# Altium project B108AA.PrjPcb (part 3 of 4)

## Sheet GSM Modem Antenna.SchDoc: GSM 2G Antenna Filter
size 292 x 193 mm; DocumentNumber: 14; SheetNumber: 34; SheetTotal: 40
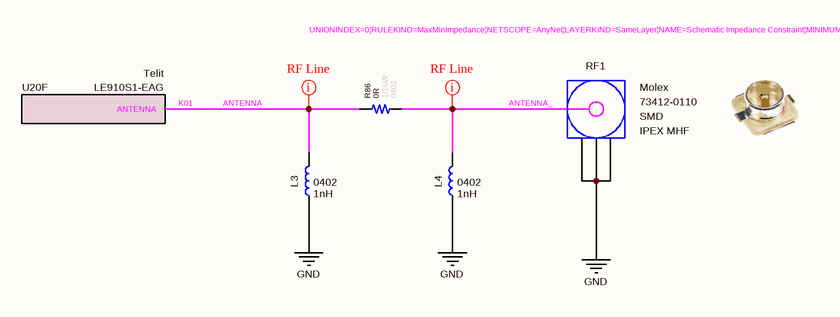
[diagram p25: GSM Modem Antenna.SchDoc]

### Parts
L3  value 1nH  Case: 0402  [INDUCTOR_0402]  (hidden comment: Fixed Inductor)
L4  value 1nH  Case: 0402  [INDUCTOR_0402]  (hidden comment: Fixed Inductor)
R86  value 0R  Case: 0402  Power: 1/16W  [RESISTOR_0402]  (hidden comment: 0R - 0402 - %1 - 1/16W)
RF1  Connector Type: IPEX MHF  Case: SMD  Manufacturer Name: Molex  [Connector_IPEX]  (hidden comment: 73412-0110)
U20  Manufacturer Part Number: LE910S1-EAG  Manufacturer Name: Telit  [LE910 GSM Modem]  (hidden comment: LE910S1-EAG LTE GSM Module)  (part F of 19)

### Nets
GND: L3.1 L4.1 RF1.2(GND) RF1.3(GND) RF1.4(GND)
ANTENNA: L3.2 R86.2 U20.K01(ANTENNA)
ANTENNA_: L4.2 R86.1 RF1.1(Signal)

### Layout directives
rule Impedance Constraint [Min = 49.00    Max = 50.00    ]: ANTENNA, ANTENNA_

### Notes on the sheet
- © 2021 All rights reserved.
  This document may not, in whole or in part, be copied, photocopied, reproduced, translated or converted to any electronic or machine readable from without prior written permission of Mehmet Günce Akkoyun.
  Engineer contact : akkoyun@me.com
- Property of
- Engineer :
- Date :
- Size :
- A4
- Time :
- Project :
- Page :
- /
- Customer :
- Product ID :
- Module ID :
- Version :
- File :
- Revision :

### Library data of the parts
L3 L4 = Inductor - 1nH [0402]: Manufacturer Name: Murata Electronics; Manufacturer Part Number: LQG15HN1N0S02D; Tolerance: 0.3 nH; Height: 0.35mm; ComponentLink1Description: DataSheet; ComponentLink1URL: https://www.mouser.com.tr/datasheet/2/281/JELF243B-0009-1699631.pdf
R86 = Resistor - 0R [0402]: Thick Film Resistors - SMD 1/16 W 0 Ohm; Manufacturer Name: Vishay; Manufacturer Part Number: CRCW04020000Z0ED; ComponentLink1Description: DataSheet; ComponentLink1URL: https://www.mouser.com.tr/datasheet/2/427/dcrcwe3-1762152.pdf; ComponentLink2Description: Mouser; ComponentLink2URL: https://www.mouser.com.tr/ProductDetail/Vishay-Dale/CRCW04020000Z0ED?qs=sGAEpiMZZMu61qfTUdNhG2DpbjADlD3GG34cJb50zyg%3D
RF1 = Connector - IPEX MHF: MOLEX   73412-0110   RF COAXIAL, MICROCOAXIAL, JACK, 50OHM; ROHS: Yes; Product Type: RF Connectors; Impedance: 50 Ohm; Manufacturer Part Number: 73412-0110
U20 = IC - LE910S1-EAG: Telit LE910S1-EAG GPRS/GNSS Module; Case: BGA

## Sheet GSM Status LED Driver.SchDoc: Status LED Driver
size 292 x 193 mm; SheetNumber: 32; SheetTotal: 40
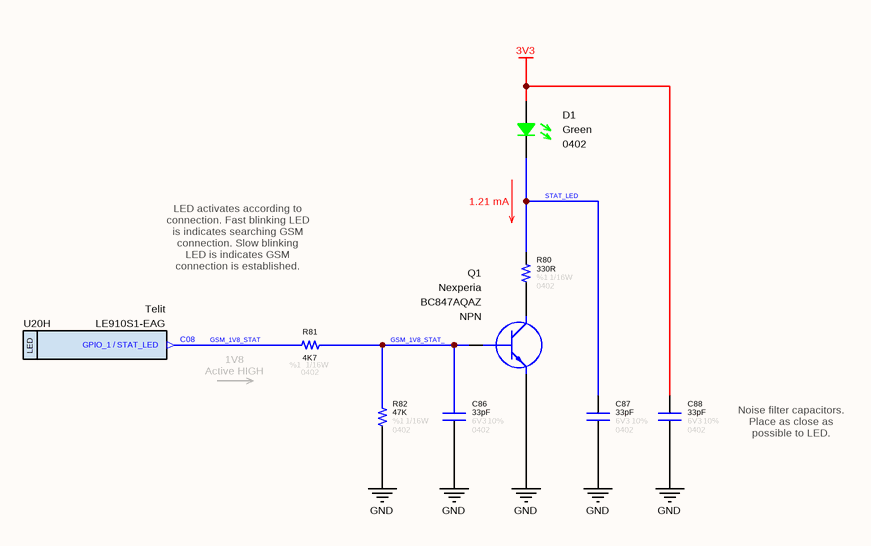
[diagram p26: GSM Status LED Driver.SchDoc]

### Parts
C86  value 33pF  Tolerance: 10%  Case: 0402  Voltage: 6V3  [CAPACITOR_0402]  (hidden comment: Capacitor - 33pF [0402] (Ceramic))
C87  value 33pF  Tolerance: 10%  Case: 0402  Voltage: 6V3  [CAPACITOR_0402]  (hidden comment: Capacitor - 33pF [0402] (Ceramic))
C88  value 33pF  Tolerance: 10%  Case: 0402  Voltage: 6V3  [CAPACITOR_0402]  (hidden comment: Capacitor - 33pF [0402] (Ceramic))
D1  Case: 0402  Color: Green  [LED_0402]  (hidden comment: SMD LED (Green))
Q1  Manufacturer Name: Nexperia  Polarity: NPN  [SOT1215]  (hidden comment: BC847AQAZ)
R80  value 330R  Case: 0402  Tolerance: %1  Power: 1/16W  [RESISTOR_0402]  (hidden comment: 330R - 0402 - %1 - 1/16W)
R81  value 4K7  Tolerance: %1  Case: 0402  Power: 1/16W  [RESISTOR_0402]  (hidden comment: 4K7 - 0402 - %1 - 1/16W)
R82  value 47K  Tolerance: %1  Case: 0402  Power: 1/16W  [RESISTOR_0402]  (hidden comment: 47K - 0402 - %1 - 1/16W)
U20  Manufacturer Part Number: LE910S1-EAG  Manufacturer Name: Telit  [LE910 GSM Modem]  (hidden comment: LE910S1-EAG LTE GSM Module)  (part H of 19)

### Nets
3V3: C88.2 D1.2
GND: C86.1 C87.1 C88.1 Q1.2(E) R82.1
GSM_1V8_STAT: R81.2 U20.C08(GPIO_1_/_STAT_LED)
GSM_1V8_STAT_: C86.2 Q1.1(B) R81.1 R82.2
STAT_LED: C87.2 D1.1 R80.2
NetQ1_3: Q1.3(C) R80.1

### Notes on the sheet
- 1.21 mA
- LED activates according to connection. Fast blinking LED is indicates searching GSM connection. Slow blinking LED is indicates GSM connection is established.
- 1V8
  Active HIGH
- Noise filter capacitors. Place as close as possible to LED.
- © 2022 All rights reserved.
  This document may not, in whole or in part, be copied, photocopied, reproduced, translated or converted to any electronic or machine readable from without prior written permission of Mehmet Günce Akkoyun.
  Engineer contact : akkoyun@me.com
- Property of
- Engineer :
- Date :
- Size :
- A4
- Time :
- Project :
- Page :
- /
- Customer :
- Product ID :
- Module ID :
- Version :
- File :
- Revision :
- (in symbol IC - LE910S1-EAG, part H) LED

### Library data of the parts
C86-C88 = Capacitor - 33pF [0402-6V3]: Manufacturer Name: Kemet; Manufacturer Part Number: C0402C330J9RACAUTO; ComponentLink1Description: DataSheet; ComponentLink1URL: https://api.kemet.com/component-edge/download/datasheet/C0402C330J9RACAUTO.pdf; ComponentLink2Description: Mouser; ComponentLink2URL: https://www.mouser.com/Search/Refine.aspx?Keyword=80-C0402C330J9RAUTO
D1 = Diode - LED (0402-Green): Standard LEDs - SMD MINI-MOLD ULTRA COMPACT GREEN; Manufacturer Name: ROHM Semiconductor; Manufacturer Part Number: SML-P12MTT86R; ROHS: Yes; ComponentLink1Description: DataSheet; ComponentLink1URL: https://www.mouser.com.tr/datasheet/2/348/sml-p1-e-1139198.pdf; ComponentLink2Description: Mouser; ComponentLink2URL: https://www.mouser.com.tr/ProductDetail/ROHM-Semiconductor/SML-P12U2TT86R?qs=sGAEpiMZZMseGfSY3csMkRIBDsfU3UCXJTULB5gem9Ta%252Bp%252BvZ709fg%3D%3D
Q1 = Transistor - BC847: Bipolar NPN Transistors; Case: DFN-1010D-3; Manufacturer Part Number: BC847AQAZ
R80 = Resistor - 330R [0402]: Thick Film Resistors - SMD 1/16 W 330 Ohm 1%; Manufacturer Name: Vishay; Manufacturer Part Number: CRCW0402330RFKED; ComponentLink1Description: DataSheet; ComponentLink1URL: https://www.mouser.com.tr/datasheet/2/427/dcrcwe3-1762152.pdf; ComponentLink2Description: Mouser; ComponentLink2URL: https://www.mouser.com.tr/ProductDetail/Vishay-Dale/CRCW0402330RFKED?qs=sGAEpiMZZMu61qfTUdNhG2DpbjADlD3GGS6SwBlLi5Q%3D
R81 = Resistor - 4K7 [0402]: Thick Film Resistors - SMD 1/16 W 4.7 KOhm 1%; Manufacturer Name: Vishay; Manufacturer Part Number: CRCW04024K70FKED; ComponentLink1Description: DataSheet; ComponentLink1URL: https://www.mouser.com.tr/datasheet/2/427/dcrcwe3-1762152.pdf; ComponentLink2Description: Mouser; ComponentLink2URL: https://www.mouser.com.tr/ProductDetail/Vishay-Dale/CRCW04024K70FKED?qs=sGAEpiMZZMu61qfTUdNhG7nHf%2F6MTUn3HadIdDQu24Q%3D
R82 = Resistor - 47K [0402]: Thick Film Resistors - SMD 1/16 W 47 KOhm 1%; Manufacturer Name: Vishay; Manufacturer Part Number: CRCW040247K0FKED; ComponentLink1Description: DataSheet; ComponentLink1URL: https://www.mouser.com.tr/datasheet/2/427/dcrcwe3-1762152.pdf; ComponentLink2Description: Mouser; ComponentLink2URL: https://www.mouser.com.tr/ProductDetail/Vishay-Dale/CRCW040247K0FKED?qs=sGAEpiMZZMu61qfTUdNhG2DpbjADlD3GL%252B3h1elTxqU%3D
U20 = IC - LE910S1-EAG: Telit LE910S1-EAG GPRS/GNSS Module; Case: BGA

## Sheet GSM SIM Socket.SchDoc: GSM SIM Socket
size 292 x 193 mm; DocumentNumber: 15; SheetNumber: 30; SheetTotal: 40
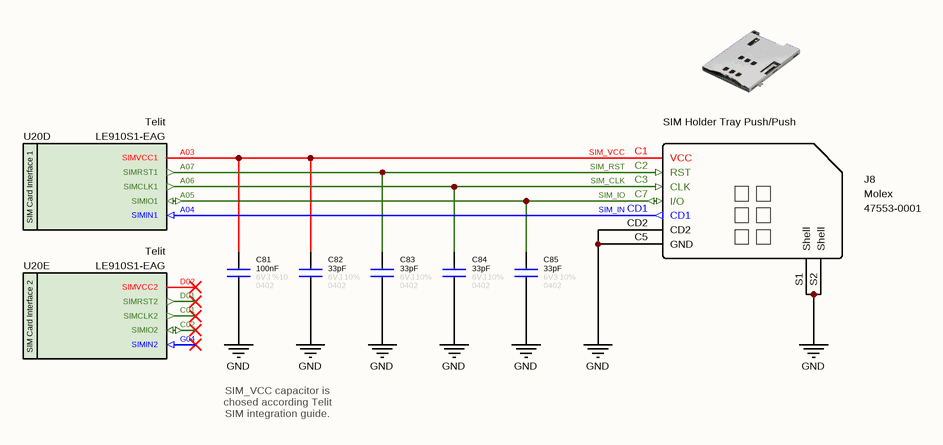
[diagram p27: GSM SIM Socket.SchDoc]

### Parts
C81  value 100nF  Tolerance: %10  Voltage: 6V3  Case: 0402  [CAPACITOR_0402]  (hidden comment: Capacitor - 100nF [0402] (Ceramic))
C82  value 33pF  Tolerance: 10%  Case: 0402  Voltage: 6V3  [CAPACITOR_0402]  (hidden comment: Capacitor - 33pF [0402] (Ceramic))
C83  value 33pF  Tolerance: 10%  Case: 0402  Voltage: 6V3  [CAPACITOR_0402]  (hidden comment: Capacitor - 33pF [0402] (Ceramic))
C84  value 33pF  Tolerance: 10%  Case: 0402  Voltage: 6V3  [CAPACITOR_0402]  (hidden comment: Capacitor - 33pF [0402] (Ceramic))
C85  value 33pF  Tolerance: 10%  Case: 0402  Voltage: 6V3  [CAPACITOR_0402]  (hidden comment: Capacitor - 33pF [0402] (Ceramic))
J8  Card Type: SIM Holder Tray Push/Push  Manufacturer Name: Molex  Manufacturer Part Number: 47553-0001  [CONNECTOR - SIM Card]  (hidden comment: SIM Holder Tray)
U20  Manufacturer Part Number: LE910S1-EAG  Manufacturer Name: Telit  [LE910 GSM Modem]  (hidden comment: LE910S1-EAG LTE GSM Module)  (parts D,E of 19)

### Nets
GND: C81.1 C82.1 C83.1 C84.1 C85.1 J8.C5(GND) J8.CD2 J8.S1(Shell) J8.S2(Shell)
SIM_CLK: C84.2 J8.C3(CLK) U20.A06(SIMCLK1)
SIM_IN: J8.CD1 U20.A04(SIMIN1)
SIM_IO: C85.2 J8.C7(I/O) U20.A05(SIMIO1)
SIM_RST: C83.2 J8.C2(RST) U20.A07(SIMRST1)
SIM_VCC: C81.2 C82.2 J8.C1(VCC) U20.A03(SIMVCC1)

Not connected (* = marked no-connect by the designer): U20 C01(SIMCLK2)* C02(SIMIO2)* D01(SIMRST2)* D02(SIMVCC2)* G04(SIMIN2)*

### Notes on the sheet
- SIM_VCC capacitor is chosed according Telit SIM integration guide.
- © 2021 All rights reserved.
  This document may not, in whole or in part, be copied, photocopied, reproduced, translated or converted to any electronic or machine readable from without prior written permission of Mehmet Günce Akkoyun.
  Engineer contact : akkoyun@me.com
- Property of
- Engineer :
- Date :
- Size :
- A4
- Time :
- Project :
- Page :
- /
- Customer :
- Product ID :
- Module ID :
- Version :
- File :
- Revision :
- (in symbol IC - LE910S1-EAG, part D) SIM Card Interface 1
- (in symbol IC - LE910S1-EAG, part E) SIM Card Interface 2

### Library data of the parts
C81 = Capacitor - 100nF [0402-6V3]: Capacitor - 100nF [0402-6V3] (Ceramic); Manufacturer Name: AVX; Manufacturer Part Number: 04026D104KAT4A; ComponentLink1Description: Mouser; ComponentLink1URL: https://www.mouser.com.tr/ProductDetail/AVX/04026D104KAT4A?qs=sGAEpiMZZMs0AnBnWHyRQPg4iYkCw7IMED%2F4kpqgf7w%3D; ComponentLink2Description: DataSheet; ComponentLink2URL: https://www.mouser.com.tr/datasheet/2/40/cx5r-776519.pdf
C82-C85 = Capacitor - 33pF [0402-6V3]: as C86 on sheet GSM Status LED Driver; ComponentLink1Description: DataSheet; ComponentLink1URL: https://api.kemet.com/component-edge/download/datasheet/C0402C330J9RACAUTO.pdf; ComponentLink2Description: Mouser; ComponentLink2URL: https://www.mouser.com/Search/Refine.aspx?Keyword=80-C0402C330J9RAUTO
J8 = Connector - Sim Holder: Memory Card Connectors ASSY 1.90 SIM CARD R IM CARD READER CONN.
U20 = IC - LE910S1-EAG: Telit LE910S1-EAG GPRS/GNSS Module; Case: BGA

## Sheet GSM Power Source.SchDoc: GSM IoT Power Filter
size 393 x 292 mm; DocumentNumber: 8; SheetNumber: 24; SheetTotal: 40
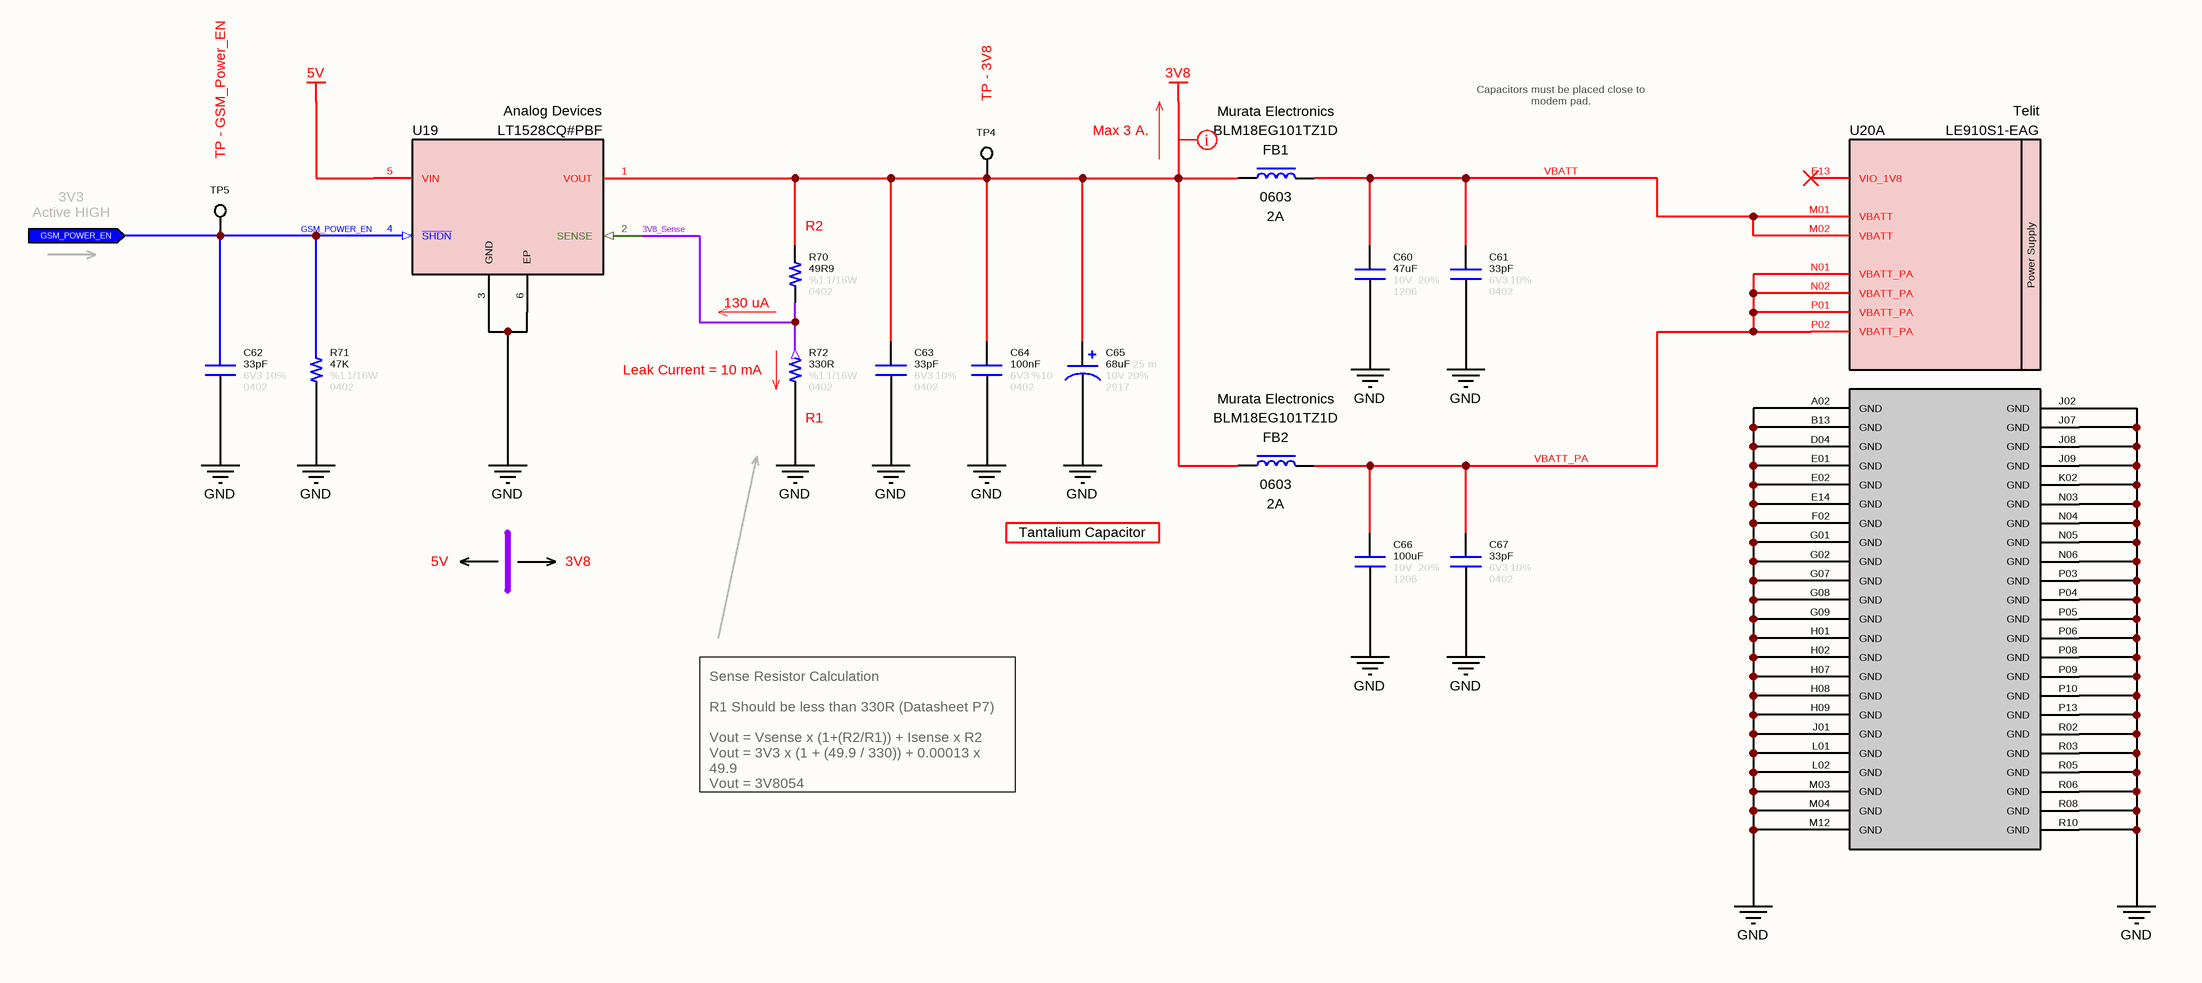
[diagram p28: GSM Power Source.SchDoc]

### Parts
C60  value 47uF  Tolerance: 20%  Case: 1206  Voltage: 10V  [CAPACITOR_1206]  (hidden comment: Capacitor - 47uF [1206] (Ceramic))
C61  value 33pF  Tolerance: 10%  Case: 0402  Voltage: 6V3  [CAPACITOR_0402]  (hidden comment: Capacitor - 33pF [0402] (Ceramic))
C62  value 33pF  Tolerance: 10%  Case: 0402  Voltage: 6V3  [CAPACITOR_0402]  (hidden comment: Capacitor - 33pF [0402] (Ceramic))
C63  value 33pF  Tolerance: 10%  Case: 0402  Voltage: 6V3  [CAPACITOR_0402]  (hidden comment: Capacitor - 33pF [0402] (Ceramic))
C64  value 100nF  Tolerance: %10  Voltage: 6V3  Case: 0402  [CAPACITOR_0402]  (hidden comment: Capacitor - 100nF [0402] (Ceramic))
C65  value 68uF  ESR: 25 m  Tolerance: 20%  Case: 2917  Voltage: 10V  [CAP_10TPE68M]  (hidden comment: Capacitor - 68uF [2917] (Tantalum))
C66  value 100uF  Tolerance: 20%  Case: 1206  Voltage: 10V  [CAPACITOR_1206]  (hidden comment: Capacitor - 100uF [1206] (Ceramic))
C67  value 33pF  Tolerance: 10%  Case: 0402  Voltage: 6V3  [CAPACITOR_0402]  (hidden comment: Capacitor - 33pF [0402] (Ceramic))
FB1  Maximum DC Current: 2A  Case: 0603  Manufacturer Part Number: BLM18EG101TZ1D  Manufacturer Name: Murata Electronics  [INDUCTOR_0603]  (hidden comment: Ferrite Bead)
FB2  Maximum DC Current: 2A  Case: 0603  Manufacturer Part Number: BLM18EG101TZ1D  Manufacturer Name: Murata Electronics  [INDUCTOR_0603]  (hidden comment: Ferrite Bead)
R70  value 49R9  Case: 0402  Tolerance: %1  Power: 1/16W  [RESISTOR_0402]  (hidden comment: 49R9 - 0402 - %1 - 1/16W)
R71  value 47K  Tolerance: %1  Case: 0402  Power: 1/16W  [RESISTOR_0402]  (hidden comment: 47K - 0402 - %1 - 1/16W)
R72  value 330R  Case: 0402  Tolerance: %1  Power: 1/16W  [RESISTOR_0402]  (hidden comment: 330R - 0402 - %1 - 1/16W)
TP4  TP - 3V8  [TP]  (no BOM)
TP5  TP - GSM_Power_EN  [TP]  (no BOM)
U19  Manufacturer Part Number: LT1528CQ#PBF  Manufacturer Name: Analog Devices  [DDPAK-5]  (hidden comment: LDO Regulator)
U20  Manufacturer Part Number: LE910S1-EAG  Manufacturer Name: Telit  [LE910 GSM Modem]  (hidden comment: LE910S1-EAG LTE GSM Module)  (part A of 19)

### Ports
GSM_POWER_EN (in)

### Nets
3V8: C63.2 C64.2 C65.1 FB1.1 FB2.1 R70.2 TP4.1 U19.1(VOUT)
5V: U19.5(VIN)
GND: C60.1 C61.1 C62.1 C63.1 C64.1 C65.2 C66.1 C67.1 R71.1 R72.1 U19.3(GND) U19.6(EP) U20.A02(GND) U20.B13(GND) U20.D04(GND) U20.E01(GND) U20.E02(GND) U20.E14(GND) U20.F02(GND) U20.G01(GND) U20.G02(GND) U20.G07(GND) U20.G08(GND) U20.G09(GND) U20.H01(GND) U20.H02(GND) U20.H07(GND) U20.H08(GND) U20.H09(GND) U20.J01(GND) U20.J02(GND) U20.J07(GND) U20.J08(GND) U20.J09(GND) U20.K02(GND) U20.L01(GND) U20.L02(GND) U20.M03(GND) U20.M04(GND) U20.M12(GND) U20.N03(GND) U20.N04(GND) U20.N05(GND) U20.N06(GND) U20.P03(GND) U20.P04(GND) U20.P05(GND) U20.P06(GND) U20.P08(GND) U20.P09(GND) U20.P10(GND) U20.P13(GND) U20.R02(GND) U20.R03(GND) U20.R05(GND) U20.R06(GND) U20.R08(GND) U20.R10(GND)
3V8_Sense: R70.1 R72.2 U19.2(SENSE)
GSM_POWER_EN: C62.2 R71.2 TP5.1 U19.4(~{SHDN}) ; port GSM_POWER_EN
VBATT: C60.2 C61.2 FB1.2 U20.M01(VBATT) U20.M02(VBATT)
VBATT_PA: C66.2 C67.2 FB2.2 U20.N01(VBATT_PA) U20.N02(VBATT_PA) U20.P01(VBATT_PA) U20.P02(VBATT_PA)

Not connected (* = marked no-connect by the designer): U20 E13(VIO_1V8)*

### Layout directives
rule Supply Nets [Voltage = 3.800]: 3V8

### Notes on the sheet
- Max 3 A.
- Capacitors must be placed close to modem pad.
- 3V3
  Active HIGH
- (near R70) 130 uA
- (near R70) R2
- (near R72) Leak Current = 10 mA
- (near R72) R1
- 5V
- 3V8
- Tantalium Capacitor
- Sense Resistor Calculation
  R1 Should be less than 330R (Datasheet P7)
  Vout = Vsense x (1+(R2/R1)) + Isense x R2
  Vout = 3V3 x (1 + (49.9 / 330)) + 0.00013 x 49.9
  Vout = 3V8054
- © 2022 All rights reserved.
  This document may not, in whole or in part, be copied, photocopied, reproduced, translated or converted to any electronic or machine readable from without prior written permission of Mehmet Günce Akkoyun.
  Engineer contact : akkoyun@me.com
- Property of
- Engineer :
- Date :
- Size :
- A3
- Time :
- Project :
- Page :
- /
- Customer :
- Product ID :
- Module ID :
- Version :
- File :
- Revision :
- (in symbol IC - LE910S1-EAG, part A) Power Supply

### Library data of the parts
C60 = Capacitor - 47uF [1206-10V]: Multilayer Ceramic Capacitors MLCC - SMD/SMT 47UF 10V 20% 1206; Manufacturer Part Number: C1206C476M8PAC; Manufacturer Name: Kemet
C61-C63 C67 = Capacitor - 33pF [0402-6V3]: as C86 on sheet GSM Status LED Driver; ComponentLink1Description: DataSheet; ComponentLink1URL: https://api.kemet.com/component-edge/download/datasheet/C0402C330J9RACAUTO.pdf; ComponentLink2Description: Mouser; ComponentLink2URL: https://www.mouser.com/Search/Refine.aspx?Keyword=80-C0402C330J9RAUTO
C64 = Capacitor - 100nF [0402-6V3]: as C81 on sheet GSM SIM Socket; ComponentLink1Description: Mouser; ComponentLink1URL: https://www.mouser.com.tr/ProductDetail/AVX/04026D104KAT4A?qs=sGAEpiMZZMs0AnBnWHyRQPg4iYkCw7IMED%2F4kpqgf7w%3D; ComponentLink2Description: DataSheet; ComponentLink2URL: https://www.mouser.com.tr/datasheet/2/40/cx5r-776519.pdf
C65 = Capacitor - 68uF [2917-10V] (Tantalium): Tantalum Capacitors - Polymer 10V 68uF 2917 20% ESR=25mOhms; Manufacturer Name: Panasonic; Manufacturer Part Number: 10TPE68M
C66 = Capacitor - 100uF [1206-10V]: Multilayer Ceramic Capacitors MLCC - SMD/SMT 100UF 10V 20% 1206; Manufacturer Part Number: GRM31CR61A107MEA8L; Manufacturer Name: Murata
FB1 FB2 = Inductor - Ferrite Bead [SMD]: Ferrite Beads 0603 100ohms 2000mA Auto Infotainment; Maximum DC Resistance: 45 mOhms; Tolerance: 25%; Value: BLM18EG101TZ1D; Height: 0.75mm; Maximum Operating Temperature: + 125; Minimum Operating Temperature: -55
R70 = Resistor - 49R9 [0402]: Thick Film Resistors - SMD 1/16 W 49.9 Ohm 1%; Manufacturer Name: Vishay; Manufacturer Part Number: CRCW040249R9FKED; ComponentLink1Description: DataSheet; ComponentLink1URL: https://www.mouser.com.tr/datasheet/2/427/dcrcwe3-1762152.pdf; ComponentLink2Description: Mouser; ComponentLink2URL: https://www.mouser.com.tr/ProductDetail/Vishay-Dale/CRCW0402330RFKED?qs=sGAEpiMZZMu61qfTUdNhG2DpbjADlD3GGS6SwBlLi5Q%3D
R71 = Resistor - 47K [0402]: as R82 on sheet GSM Status LED Driver; ComponentLink1Description: DataSheet; ComponentLink1URL: https://www.mouser.com.tr/datasheet/2/427/dcrcwe3-1762152.pdf; ComponentLink2Description: Mouser; ComponentLink2URL: https://www.mouser.com.tr/ProductDetail/Vishay-Dale/CRCW040247K0FKED?qs=sGAEpiMZZMu61qfTUdNhG2DpbjADlD3GL%252B3h1elTxqU%3D
R72 = Resistor - 330R [0402]: as R80 on sheet GSM Status LED Driver; ComponentLink1Description: DataSheet; ComponentLink1URL: https://www.mouser.com.tr/datasheet/2/427/dcrcwe3-1762152.pdf; ComponentLink2Description: Mouser; ComponentLink2URL: https://www.mouser.com.tr/ProductDetail/Vishay-Dale/CRCW0402330RFKED?qs=sGAEpiMZZMu61qfTUdNhG2DpbjADlD3GGS6SwBlLi5Q%3D
TP4 TP5 = PCB - Test Point: Test Point
U19 = IC - LT1528CQ: LDO Voltage Regulators 3A L Drop Reg for uP Applications; Height: 1.45mm; Case: DDPAK-5
U20 = IC - LE910S1-EAG: Telit LE910S1-EAG GPRS/GNSS Module; Case: BGA

## Sheet GSM UnUsed.SchDoc: GSM UnUsed Segment
size 292 x 193 mm; SheetNumber: 37; SheetTotal: 40
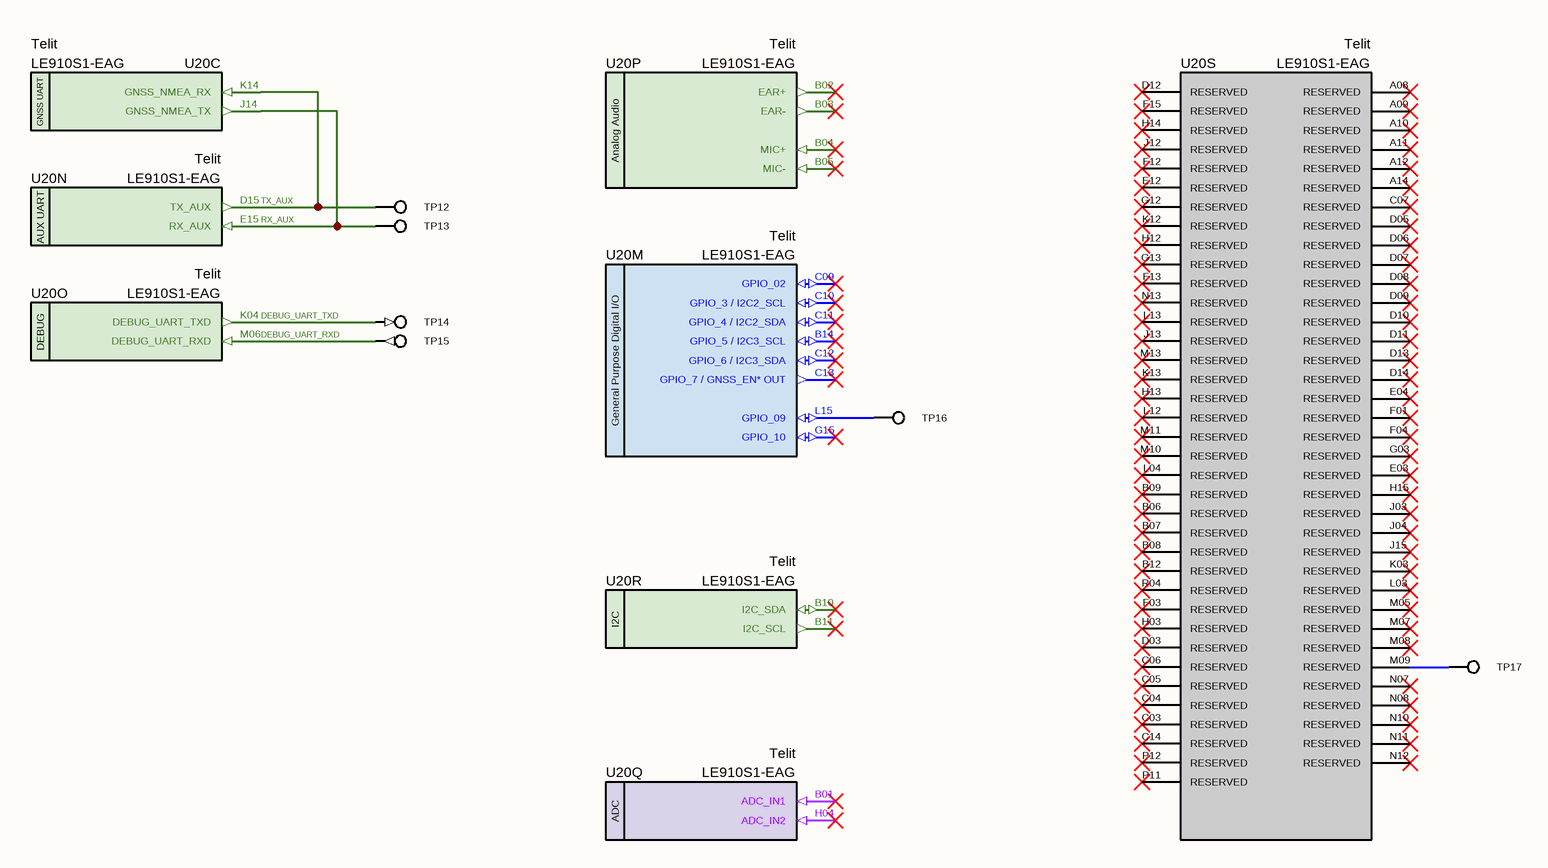
[diagram p29: GSM UnUsed.SchDoc]

### Parts
TP12  TP - GSM_Power_EN  [TP]  (value not drawn)  (no BOM)
TP13  TP - GSM_Power_EN  [TP]  (value not drawn)  (no BOM)
TP14  TP - GSM_Power_EN  [TP]  (value not drawn)  (no BOM)
TP15  TP - GSM_Power_EN  [TP]  (value not drawn)  (no BOM)
TP16  TP - GSM_Power_EN  [TP]  (value not drawn)  (no BOM)
TP17  TP - GSM_Power_EN  [TP]  (value not drawn)  (no BOM)
U20  Manufacturer Part Number: LE910S1-EAG  Manufacturer Name: Telit  [LE910 GSM Modem]  (hidden comment: LE910S1-EAG LTE GSM Module)  (parts C,M,N,O,P,Q,R,S of 19)

### Nets
DEBUG_UART_RXD: TP15.1 U20.M06(DEBUG_UART_RXD)
DEBUG_UART_TXD: TP14.1 U20.K04(DEBUG_UART_TXD)
RX_AUX: TP13.1 U20.E15(RX_AUX) U20.J14(GNSS_NMEA_TX)
TX_AUX: TP12.1 U20.D15(TX_AUX) U20.K14(GNSS_NMEA_RX)
NetTP16_1: TP16.1 U20.L15(GPIO_09)
NetTP17_1: TP17.1 U20.M09(RESERVED)

Not connected (* = marked no-connect by the designer): U20 A08(RESERVED)* A09(RESERVED)* A10(RESERVED)* A11(RESERVED)* A12(RESERVED)* A14(RESERVED)* B01(ADC_IN1)* B02(EAR+)* B03(EAR-)* B04(MIC+)* B05(MIC-)* B06(RESERVED)* B07(RESERVED)* B08(RESERVED)* B09(RESERVED)* B10(I2C_SDA)* B11(I2C_SCL)* B12(RESERVED)* B14(GPIO_5_/_I2C3_SCL)* C03(RESERVED)* C04(RESERVED)* C05(RESERVED)* C06(RESERVED)* C07(RESERVED)* C09(GPIO_02)* C10(GPIO_3_/_I2C2_SCL)* C11(GPIO_4_/_I2C2_SDA)* C12(GPIO_6_/_I2C3_SDA)* C13(GPIO_7_/_GNSS_EN*_OUT)* C14(RESERVED)* D03(RESERVED)* D05(RESERVED)* D06(RESERVED)* D07(RESERVED)* D08(RESERVED)* D09(RESERVED)* D10(RESERVED)* D11(RESERVED)* D12(RESERVED)* D13(RESERVED)* D14(RESERVED)* E03(RESERVED)* E04(RESERVED)* E12(RESERVED)* F01(RESERVED)* F03(RESERVED)* F04(RESERVED)* F12(RESERVED)* F13(RESERVED)* F15(RESERVED)* G03(RESERVED)* G12(RESERVED)* G13(RESERVED)* G15(GPIO_10)* H03(RESERVED)* H04(ADC_IN2)* H12(RESERVED)* H13(RESERVED)* H14(RESERVED)* H15(RESERVED)* J03(RESERVED)* J04(RESERVED)* J12(RESERVED)* J13(RESERVED)* J15(RESERVED)* K03(RESERVED)* K12(RESERVED)* K13(RESERVED)* L03(RESERVED)* L04(RESERVED)* L12(RESERVED)* L13(RESERVED)* M05(RESERVED)* M07(RESERVED)* M08(RESERVED)* M10(RESERVED)* M11(RESERVED)* M13(RESERVED)* N07(RESERVED)* N08(RESERVED)* N10(RESERVED)* N11(RESERVED)* N12(RESERVED)* N13(RESERVED)* P11(RESERVED)* P12(RESERVED)* R04(RESERVED)*

### Notes on the sheet
- © 2021 All rights reserved.
  This document may not, in whole or in part, be copied, photocopied, reproduced, translated or converted to any electronic or machine readable from without prior written permission of Mehmet Günce Akkoyun.
  Engineer contact : akkoyun@me.com
- Property of
- Engineer :
- Date :
- Size :
- A4
- Time :
- Project :
- Page :
- /
- Customer :
- Product ID :
- Module ID :
- Version :
- File :
- Revision :
- (in symbol IC - LE910S1-EAG, part C) GNSS UART
- (in symbol IC - LE910S1-EAG, part M) General Purpose Digital I/O
- (in symbol IC - LE910S1-EAG, part N) AUX UART
- (in symbol IC - LE910S1-EAG, part O) DEBUG
- (in symbol IC - LE910S1-EAG, part P) Analog Audio
- (in symbol IC - LE910S1-EAG, part Q) ADC
- (in symbol IC - LE910S1-EAG, part R) I2C

### Library data of the parts
TP12-TP17 = PCB - Test Point: Test Point
U20 = IC - LE910S1-EAG: Telit LE910S1-EAG GPRS/GNSS Module; Case: BGA

## Sheet GNSS Antenna.SchDoc: GNSS Antenna & LNA
size 292 x 193 mm; SheetNumber: 35; SheetTotal: 40
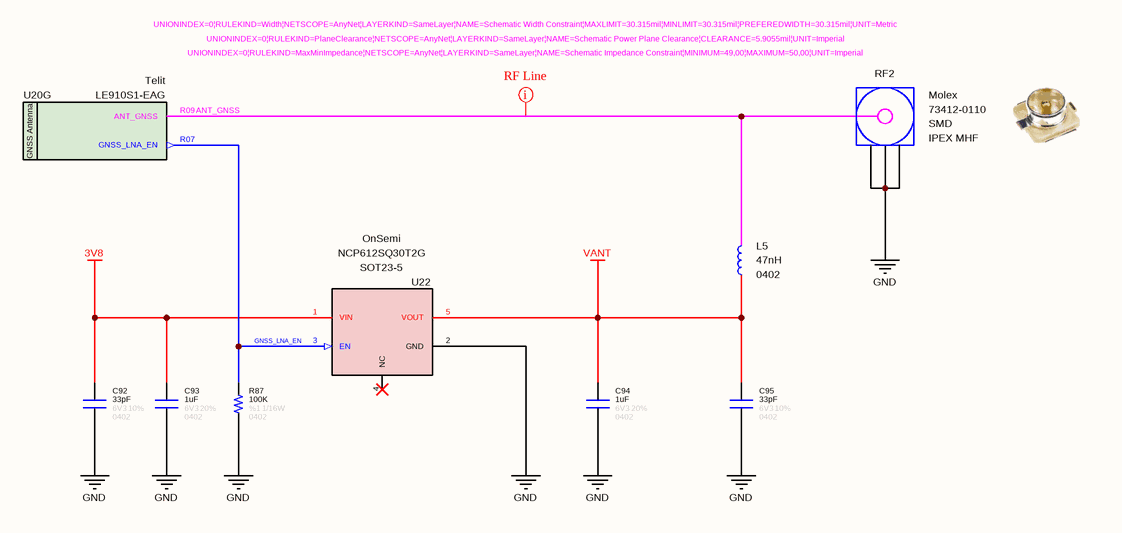
[diagram p30: GNSS Antenna.SchDoc]

### Parts
C92  value 33pF  Tolerance: 10%  Case: 0402  Voltage: 6V3  [CAPACITOR_0402]  (hidden comment: Capacitor - 33pF [0402] (Ceramic))
C93  value 1uF  Tolerance: 20%  Case: 0402  Voltage: 6V3  [CAPACITOR_0402]  (hidden comment: Capacitor - 1uF [0402] (Ceramic))
C94  value 1uF  Tolerance: 20%  Case: 0402  Voltage: 6V3  [CAPACITOR_0402]  (hidden comment: Capacitor - 1uF [0402] (Ceramic))
C95  value 33pF  Tolerance: 10%  Case: 0402  Voltage: 6V3  [CAPACITOR_0402]  (hidden comment: Capacitor - 33pF [0402] (Ceramic))
L5  value 47nH  Case: 0402  [INDUCTOR_0603]  (hidden comment: RF Inductors - SMD)
R87  value 100K  Tolerance: %1  Case: 0402  Power: 1/16W  [RESISTOR_0402]  (hidden comment: 100K - 0402 - %1 - 1/16W)
RF2  Connector Type: IPEX MHF  Case: SMD  Manufacturer Name: Molex  [Connector_IPEX]  (hidden comment: 73412-0110)
U20  Manufacturer Part Number: LE910S1-EAG  Manufacturer Name: Telit  [LE910 GSM Modem]  (hidden comment: LE910S1-EAG LTE GSM Module)  (part G of 19)
U22  Manufacturer Name: OnSemi  Case: SOT23-5  [SOT-23-5]  (hidden comment: NCP612SQ30T2G)

### Nets
3V8: C92.2 C93.2 U22.1(VIN)
GND: C92.1 C93.1 C94.1 C95.1 R87.1 RF2.2(GND) RF2.3(GND) RF2.4(GND) U22.2(GND)
VANT: C94.2 C95.2 L5.1 U22.5(VOUT)
ANT_GNSS: L5.2 RF2.1(Signal) U20.R09(ANT_GNSS)
GNSS_LNA_EN: R87.2 U20.R07(GNSS_LNA_EN) U22.3(EN)

Not connected (* = marked no-connect by the designer): U22 4(NC)

### Layout directives
rule Impedance Constraint [Min = 49.00    Max = 50.00    ]; rule Power Plane Clearance [Clearance = 5.906mil]; rule Width Constraint [Pref Width = 0.77mm    Min Width = 0.77mm    Max Width = 0.77mm]: ANT_GNSS

### Notes on the sheet
- © 2021 All rights reserved.
  This document may not, in whole or in part, be copied, photocopied, reproduced, translated or converted to any electronic or machine readable from without prior written permission of Mehmet Günce Akkoyun.
  Engineer contact : akkoyun@me.com
- Property of
- Engineer :
- Date :
- Size :
- A4
- Time :
- Project :
- Page :
- /
- Customer :
- Product ID :
- Module ID :
- Version :
- File :
- Revision :
- (in symbol IC - LE910S1-EAG, part G) GNSS Antenna

### Library data of the parts
C92 C95 = Capacitor - 33pF [0402-6V3]: as C86 on sheet GSM Status LED Driver; ComponentLink1Description: DataSheet; ComponentLink1URL: https://api.kemet.com/component-edge/download/datasheet/C0402C330J9RACAUTO.pdf; ComponentLink2Description: Mouser; ComponentLink2URL: https://www.mouser.com/Search/Refine.aspx?Keyword=80-C0402C330J9RAUTO
C93 C94 = Capacitor - 1uF [0402-6V3]: Multilayer Ceramic Capacitors - SMD - 6.3V 1uF X5R 0402 20%; Manufacturer Part Number: GRM153R60J105ME95D; Manufacturer Name: Murata
L5 = Inductor - LQW15AN47NG00D: RF Inductors - SMD 47 NH 2%; Manufacturer Name: Murata Electronics; Height: 0.5mm; Manufacturer Part Number: LQW15AN47NG00D; Tolerance: 2%; ComponentLink1Description: DataSheet; ComponentLink1URL: https://www.mouser.com.tr/datasheet/2/281/JELF243B-0009-1699631.pdf
R87 = Resistor - 100K [0402]: Thick Film Resistors - SMD 1/16 W 100 KOhm 1%; Manufacturer Name: Vishay; Manufacturer Part Number: CRCW0402100KFKED; ComponentLink1Description: DataSheet; ComponentLink1URL: https://www.mouser.com.tr/datasheet/2/427/dcrcwe3-1762152.pdf; ComponentLink2Description: Mouser; ComponentLink2URL: https://www.mouser.com.tr/ProductDetail/Vishay-Dale/CRCW040210K0FKED?qs=sGAEpiMZZMu61qfTUdNhG2DpbjADlD3GcalbOv9utCY%3D
RF2 = Connector - IPEX MHF: as RF1 on sheet GSM Modem Antenna; ROHS: Yes; Product Type: RF Connectors; Impedance: 50 Ohm; Manufacturer Part Number: 73412-0110
U20 = IC - LE910S1-EAG: Telit LE910S1-EAG GPRS/GNSS Module; Case: BGA
U22 = IC - NCP612SQ30T2G: LDO Voltage Regulators ACMOS1 LDO REGULATOR; RoHS: Yes; Product Type: LDO Voltage Regulators; Manufacturer Part Number: NCP612SQ30T2G

## Sheet GSM PPS LED Driver.SchDoc: GNSS PPS LED Driver
size 292 x 193 mm; SheetNumber: 33; SheetTotal: 40
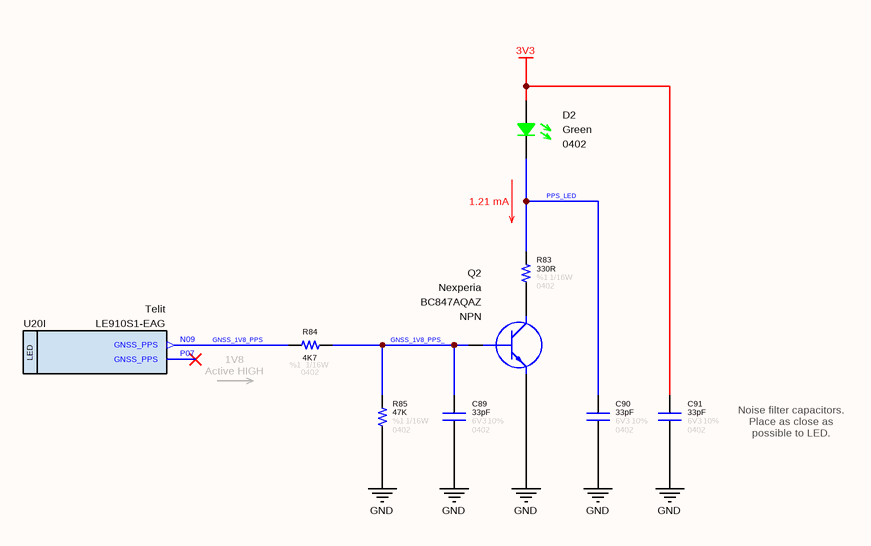
[diagram p31: GSM PPS LED Driver.SchDoc]

### Parts
C89  value 33pF  Tolerance: 10%  Case: 0402  Voltage: 6V3  [CAPACITOR_0402]  (hidden comment: Capacitor - 33pF [0402] (Ceramic))
C90  value 33pF  Tolerance: 10%  Case: 0402  Voltage: 6V3  [CAPACITOR_0402]  (hidden comment: Capacitor - 33pF [0402] (Ceramic))
C91  value 33pF  Tolerance: 10%  Case: 0402  Voltage: 6V3  [CAPACITOR_0402]  (hidden comment: Capacitor - 33pF [0402] (Ceramic))
D2  Case: 0402  Color: Green  [LED_0402]  (hidden comment: SMD LED (Green))
Q2  Manufacturer Name: Nexperia  Polarity: NPN  [SOT1215]  (hidden comment: BC847AQAZ)
R83  value 330R  Case: 0402  Tolerance: %1  Power: 1/16W  [RESISTOR_0402]  (hidden comment: 330R - 0402 - %1 - 1/16W)
R84  value 4K7  Tolerance: %1  Case: 0402  Power: 1/16W  [RESISTOR_0402]  (hidden comment: 4K7 - 0402 - %1 - 1/16W)
R85  value 47K  Tolerance: %1  Case: 0402  Power: 1/16W  [RESISTOR_0402]  (hidden comment: 47K - 0402 - %1 - 1/16W)
U20  Manufacturer Part Number: LE910S1-EAG  Manufacturer Name: Telit  [LE910 GSM Modem]  (hidden comment: LE910S1-EAG LTE GSM Module)  (part I of 19)

### Nets
3V3: C91.2 D2.2
GND: C89.1 C90.1 C91.1 Q2.2(E) R85.1
GNSS_1V8_PPS: R84.2 U20.N09(GNSS_PPS)
GNSS_1V8_PPS_: C89.2 Q2.1(B) R84.1 R85.2
PPS_LED: C90.2 D2.1 R83.2
NetQ2_3: Q2.3(C) R83.1

Not connected (* = marked no-connect by the designer): U20 P07(GNSS_PPS)*

### Notes on the sheet
- 1.21 mA
- 1V8
  Active HIGH
- Noise filter capacitors. Place as close as possible to LED.
- © 2022 All rights reserved.
  This document may not, in whole or in part, be copied, photocopied, reproduced, translated or converted to any electronic or machine readable from without prior written permission of Mehmet Günce Akkoyun.
  Engineer contact : akkoyun@me.com
- Property of
- Engineer :
- Date :
- Size :
- A4
- Time :
- Project :
- Page :
- /
- Customer :
- Product ID :
- Module ID :
- Version :
- File :
- Revision :
- (in symbol IC - LE910S1-EAG, part I) LED

### Library data of the parts
C89-C91 = Capacitor - 33pF [0402-6V3]: as C86 on sheet GSM Status LED Driver; ComponentLink1Description: DataSheet; ComponentLink1URL: https://api.kemet.com/component-edge/download/datasheet/C0402C330J9RACAUTO.pdf; ComponentLink2Description: Mouser; ComponentLink2URL: https://www.mouser.com/Search/Refine.aspx?Keyword=80-C0402C330J9RAUTO
D2 = Diode - LED (0402-Green): as D1 on sheet GSM Status LED Driver; ROHS: Yes; ComponentLink1Description: DataSheet; ComponentLink1URL: https://www.mouser.com.tr/datasheet/2/348/sml-p1-e-1139198.pdf; ComponentLink2Description: Mouser; ComponentLink2URL: https://www.mouser.com.tr/ProductDetail/ROHM-Semiconductor/SML-P12U2TT86R?qs=sGAEpiMZZMseGfSY3csMkRIBDsfU3UCXJTULB5gem9Ta%252Bp%252BvZ709fg%3D%3D
Q2 = Transistor - BC847: Bipolar NPN Transistors; Case: DFN-1010D-3; Manufacturer Part Number: BC847AQAZ
R83 = Resistor - 330R [0402]: as R80 on sheet GSM Status LED Driver; ComponentLink1Description: DataSheet; ComponentLink1URL: https://www.mouser.com.tr/datasheet/2/427/dcrcwe3-1762152.pdf; ComponentLink2Description: Mouser; ComponentLink2URL: https://www.mouser.com.tr/ProductDetail/Vishay-Dale/CRCW0402330RFKED?qs=sGAEpiMZZMu61qfTUdNhG2DpbjADlD3GGS6SwBlLi5Q%3D
R84 = Resistor - 4K7 [0402]: as R81 on sheet GSM Status LED Driver; ComponentLink1Description: DataSheet; ComponentLink1URL: https://www.mouser.com.tr/datasheet/2/427/dcrcwe3-1762152.pdf; ComponentLink2Description: Mouser; ComponentLink2URL: https://www.mouser.com.tr/ProductDetail/Vishay-Dale/CRCW04024K70FKED?qs=sGAEpiMZZMu61qfTUdNhG7nHf%2F6MTUn3HadIdDQu24Q%3D
R85 = Resistor - 47K [0402]: as R82 on sheet GSM Status LED Driver; ComponentLink1Description: DataSheet; ComponentLink1URL: https://www.mouser.com.tr/datasheet/2/427/dcrcwe3-1762152.pdf; ComponentLink2Description: Mouser; ComponentLink2URL: https://www.mouser.com.tr/ProductDetail/Vishay-Dale/CRCW040247K0FKED?qs=sGAEpiMZZMu61qfTUdNhG2DpbjADlD3GL%252B3h1elTxqU%3D
U20 = IC - LE910S1-EAG: Telit LE910S1-EAG GPRS/GNSS Module; Case: BGA

## Sheet GSM Signal Block Diagram.SchDoc: Signal Control Block Diagram
size 292 x 193 mm; SheetNumber: 25; SheetTotal: 40
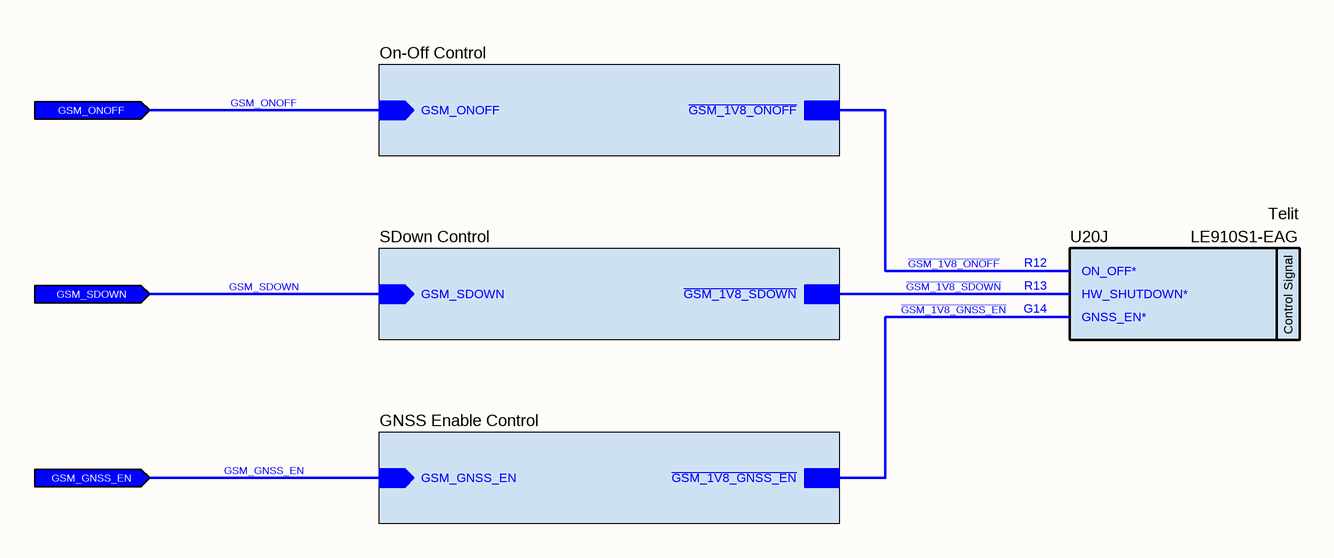
[diagram p32: GSM Signal Block Diagram.SchDoc]

### Parts
U20  Manufacturer Part Number: LE910S1-EAG  Manufacturer Name: Telit  [LE910 GSM Modem]  (hidden comment: LE910S1-EAG LTE GSM Module)  (part J of 19)

### Sub-sheets
GNSS Enable Control = GSM GNSS En Signal Control.SchDoc: GSM_GNSS_EN (in), ~{GSM_1V8_GNSS_EN}
On-Off Control = GSM On-Off Signal Control.SchDoc: GSM_ONOFF (in), ~{GSM_1V8_ONOFF}
SDown Control = GSM Shut Down Signal Control.SchDoc: GSM_SDOWN (in), ~{GSM_1V8_SDOWN}

### Ports
GSM_GNSS_EN (in), GSM_ONOFF (in), GSM_SDOWN (in)

### Nets
~{GSM_1V8_GNSS_EN}: U20.G14(GNSS_EN*) ; sheet GNSS Enable Control/~{GSM_1V8_GNSS_EN}
~{GSM_1V8_ONOFF}: U20.R12(ON_OFF*) ; sheet On-Off Control/~{GSM_1V8_ONOFF}
~{GSM_1V8_SDOWN}: U20.R13(HW_SHUTDOWN*) ; sheet SDown Control/~{GSM_1V8_SDOWN}
GSM_GNSS_EN: port GSM_GNSS_EN, sheet GNSS Enable Control/GSM_GNSS_EN
GSM_ONOFF: port GSM_ONOFF, sheet On-Off Control/GSM_ONOFF
GSM_SDOWN: port GSM_SDOWN, sheet SDown Control/GSM_SDOWN

### Notes on the sheet
- © 2022 All rights reserved.
  This document may not, in whole or in part, be copied, photocopied, reproduced, translated or converted to any electronic or machine readable from without prior written permission of Mehmet Günce Akkoyun.
  Engineer contact : akkoyun@me.com
- Property of
- Engineer :
- Date :
- Size :
- A4
- Time :
- Project :
- Page :
- /
- Customer :
- Product ID :
- Module ID :
- Version :
- File :
- Revision :
- (in symbol IC - LE910S1-EAG, part J) Control Signal

### Library data of the parts
U20 = IC - LE910S1-EAG: Telit LE910S1-EAG GPRS/GNSS Module; Case: BGA

## Sheet GSM On-Off Signal Control.SchDoc: On/Off Signal Control
size 292 x 193 mm; SheetNumber: 26; SheetTotal: 40
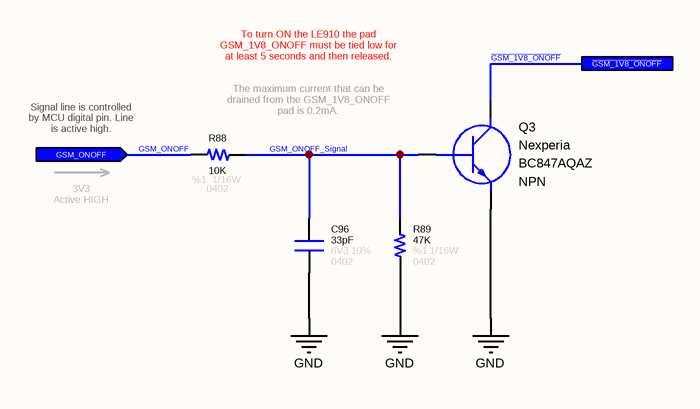
[diagram p33: GSM On-Off Signal Control.SchDoc]

### Parts
C96  value 33pF  Tolerance: 10%  Case: 0402  Voltage: 6V3  [CAPACITOR_0402]  (hidden comment: Capacitor - 33pF [0402] (Ceramic))
Q3  Manufacturer Name: Nexperia  Polarity: NPN  [SOT1215]  (hidden comment: BC847AQAZ)
R88  value 10K  Tolerance: %1  Case: 0402  Power: 1/16W  [RESISTOR_0402]  (hidden comment: 10K - 0402 - %1 - 1/16W)
R89  value 47K  Tolerance: %1  Case: 0402  Power: 1/16W  [RESISTOR_0402]  (hidden comment: 47K - 0402 - %1 - 1/16W)

### Ports
GSM_ONOFF (in), ~{GSM_1V8_ONOFF}

### Nets
GND: C96.1 Q3.2(E) R89.1
~{GSM_1V8_ONOFF}: Q3.3(C) ; port ~{GSM_1V8_ONOFF}
GSM_ONOFF: R88.2 ; port GSM_ONOFF
GSM_ONOFF_Signal: C96.2 Q3.1(B) R88.1 R89.2

### Notes on the sheet
- To turn ON the LE910 the pad GSM_1V8_ONOFF must be tied low for at least 5 seconds and then released.
- Signal line is controlled by MCU digital pin. Line is active high.
- The maximum current that can be drained from the GSM_1V8_ONOFF pad is 0.2mA.
- 3V3
  Active HIGH
- © 2022 All rights reserved.
  This document may not, in whole or in part, be copied, photocopied, reproduced, translated or converted to any electronic or machine readable from without prior written permission of Mehmet Günce Akkoyun.
  Engineer contact : akkoyun@me.com
- Property of
- Engineer :
- Date :
- Size :
- A4
- Time :
- Project :
- Page :
- /
- Customer :
- Product ID :
- Module ID :
- Version :
- File :
- Revision :

### Library data of the parts
C96 = Capacitor - 33pF [0402-6V3]: as C86 on sheet GSM Status LED Driver; ComponentLink1Description: DataSheet; ComponentLink1URL: https://api.kemet.com/component-edge/download/datasheet/C0402C330J9RACAUTO.pdf; ComponentLink2Description: Mouser; ComponentLink2URL: https://www.mouser.com/Search/Refine.aspx?Keyword=80-C0402C330J9RAUTO
Q3 = Transistor - BC847: Bipolar NPN Transistors; Case: DFN-1010D-3; Manufacturer Part Number: BC847AQAZ
R88 = Resistor - 10K [0402]: Thick Film Resistors - SMD 1/16 W 10 KOhm 1%; Manufacturer Name: Vishay; Manufacturer Part Number: CRCW040210K0FKED; ComponentLink1Description: DataSheet; ComponentLink1URL: https://www.mouser.com.tr/datasheet/2/427/dcrcwe3-1762152.pdf; ComponentLink2Description: Mouser; ComponentLink2URL: https://www.mouser.com.tr/ProductDetail/Vishay-Dale/CRCW040210K0FKED?qs=sGAEpiMZZMu61qfTUdNhG2DpbjADlD3GcalbOv9utCY%3D
R89 = Resistor - 47K [0402]: as R82 on sheet GSM Status LED Driver; ComponentLink1Description: DataSheet; ComponentLink1URL: https://www.mouser.com.tr/datasheet/2/427/dcrcwe3-1762152.pdf; ComponentLink2Description: Mouser; ComponentLink2URL: https://www.mouser.com.tr/ProductDetail/Vishay-Dale/CRCW040247K0FKED?qs=sGAEpiMZZMu61qfTUdNhG2DpbjADlD3GL%252B3h1elTxqU%3D

## Sheet GSM Shut Down Signal Control.SchDoc: Shut Down Signal Control
size 292 x 193 mm; SheetNumber: 27; SheetTotal: 40
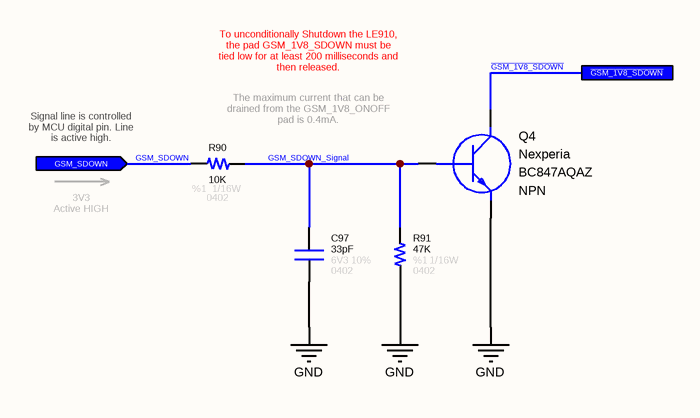
[diagram p34: GSM Shut Down Signal Control.SchDoc]

### Parts
C97  value 33pF  Tolerance: 10%  Case: 0402  Voltage: 6V3  [CAPACITOR_0402]  (hidden comment: Capacitor - 33pF [0402] (Ceramic))
Q4  Manufacturer Name: Nexperia  Polarity: NPN  [SOT1215]  (hidden comment: BC847AQAZ)
R90  value 10K  Tolerance: %1  Case: 0402  Power: 1/16W  [RESISTOR_0402]  (hidden comment: 10K - 0402 - %1 - 1/16W)
R91  value 47K  Tolerance: %1  Case: 0402  Power: 1/16W  [RESISTOR_0402]  (hidden comment: 47K - 0402 - %1 - 1/16W)

### Ports
GSM_SDOWN (in), ~{GSM_1V8_SDOWN}

### Nets
GND: C97.1 Q4.2(E) R91.1
~{GSM_1V8_SDOWN}: Q4.3(C) ; port ~{GSM_1V8_SDOWN}
GSM_SDOWN: R90.2 ; port GSM_SDOWN
GSM_SDOWN_Signal: C97.2 Q4.1(B) R90.1 R91.2

### Notes on the sheet
- To unconditionally Shutdown the LE910, the pad GSM_1V8_SDOWN must be tied low for at least 200 milliseconds and then released.
- Signal line is controlled by MCU digital pin. Line is active high.
- The maximum current that can be drained from the GSM_1V8_ONOFF pad is 0.4mA.
- 3V3
  Active HIGH
- © 2022 All rights reserved.
  This document may not, in whole or in part, be copied, photocopied, reproduced, translated or converted to any electronic or machine readable from without prior written permission of Mehmet Günce Akkoyun.
  Engineer contact : akkoyun@me.com
- Property of
- Engineer :
- Date :
- Size :
- A4
- Time :
- Project :
- Page :
- /
- Customer :
- Product ID :
- Module ID :
- Version :
- File :
- Revision :

### Library data of the parts
C97 = Capacitor - 33pF [0402-6V3]: as C86 on sheet GSM Status LED Driver; ComponentLink1Description: DataSheet; ComponentLink1URL: https://api.kemet.com/component-edge/download/datasheet/C0402C330J9RACAUTO.pdf; ComponentLink2Description: Mouser; ComponentLink2URL: https://www.mouser.com/Search/Refine.aspx?Keyword=80-C0402C330J9RAUTO
Q4 = Transistor - BC847: Bipolar NPN Transistors; Case: DFN-1010D-3; Manufacturer Part Number: BC847AQAZ
R90 = Resistor - 10K [0402]: as R88 on sheet GSM On-Off Signal Control; ComponentLink1Description: DataSheet; ComponentLink1URL: https://www.mouser.com.tr/datasheet/2/427/dcrcwe3-1762152.pdf; ComponentLink2Description: Mouser; ComponentLink2URL: https://www.mouser.com.tr/ProductDetail/Vishay-Dale/CRCW040210K0FKED?qs=sGAEpiMZZMu61qfTUdNhG2DpbjADlD3GcalbOv9utCY%3D
R91 = Resistor - 47K [0402]: as R82 on sheet GSM Status LED Driver; ComponentLink1Description: DataSheet; ComponentLink1URL: https://www.mouser.com.tr/datasheet/2/427/dcrcwe3-1762152.pdf; ComponentLink2Description: Mouser; ComponentLink2URL: https://www.mouser.com.tr/ProductDetail/Vishay-Dale/CRCW040247K0FKED?qs=sGAEpiMZZMu61qfTUdNhG2DpbjADlD3GL%252B3h1elTxqU%3D

## Sheet GSM GNSS En Signal Control.SchDoc: GNSS En Signal Control
size 292 x 193 mm; SheetNumber: 28; SheetTotal: 40
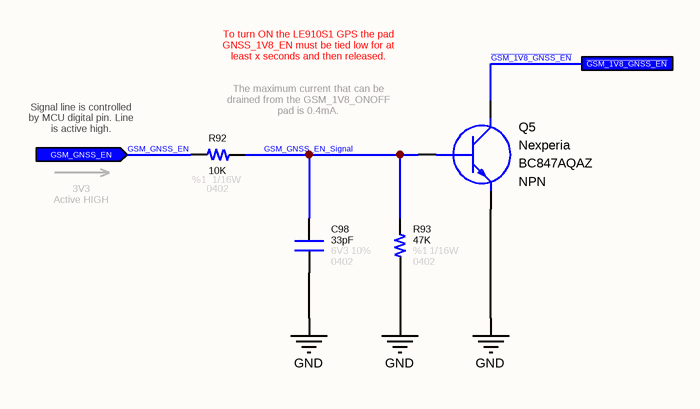
[diagram p35: GSM GNSS En Signal Control.SchDoc]

### Parts
C98  value 33pF  Tolerance: 10%  Case: 0402  Voltage: 6V3  [CAPACITOR_0402]  (hidden comment: Capacitor - 33pF [0402] (Ceramic))
Q5  Manufacturer Name: Nexperia  Polarity: NPN  [SOT1215]  (hidden comment: BC847AQAZ)
R92  value 10K  Tolerance: %1  Case: 0402  Power: 1/16W  [RESISTOR_0402]  (hidden comment: 10K - 0402 - %1 - 1/16W)
R93  value 47K  Tolerance: %1  Case: 0402  Power: 1/16W  [RESISTOR_0402]  (hidden comment: 47K - 0402 - %1 - 1/16W)

### Ports
GSM_GNSS_EN (in), ~{GSM_1V8_GNSS_EN}

### Nets
GND: C98.1 Q5.2(E) R93.1
~{GSM_1V8_GNSS_EN}: Q5.3(C) ; port ~{GSM_1V8_GNSS_EN}
GSM_GNSS_EN: R92.2 ; port GSM_GNSS_EN
GSM_GNSS_EN_Signal: C98.2 Q5.1(B) R92.1 R93.2

### Notes on the sheet
- To turn ON the LE910S1 GPS the pad GNSS_1V8_EN must be tied low for at least x seconds and then released.
- Signal line is controlled by MCU digital pin. Line is active high.
- The maximum current that can be drained from the GSM_1V8_ONOFF pad is 0.4mA.
- 3V3
  Active HIGH
- © 2022 All rights reserved.
  This document may not, in whole or in part, be copied, photocopied, reproduced, translated or converted to any electronic or machine readable from without prior written permission of Mehmet Günce Akkoyun.
  Engineer contact : akkoyun@me.com
- Property of
- Engineer :
- Date :
- Size :
- A4
- Time :
- Project :
- Page :
- /
- Customer :
- Product ID :
- Module ID :
- Version :
- File :
- Revision :

### Library data of the parts
C98 = Capacitor - 33pF [0402-6V3]: as C86 on sheet GSM Status LED Driver; ComponentLink1Description: DataSheet; ComponentLink1URL: https://api.kemet.com/component-edge/download/datasheet/C0402C330J9RACAUTO.pdf; ComponentLink2Description: Mouser; ComponentLink2URL: https://www.mouser.com/Search/Refine.aspx?Keyword=80-C0402C330J9RAUTO
Q5 = Transistor - BC847: Bipolar NPN Transistors; Case: DFN-1010D-3; Manufacturer Part Number: BC847AQAZ
R92 = Resistor - 10K [0402]: as R88 on sheet GSM On-Off Signal Control; ComponentLink1Description: DataSheet; ComponentLink1URL: https://www.mouser.com.tr/datasheet/2/427/dcrcwe3-1762152.pdf; ComponentLink2Description: Mouser; ComponentLink2URL: https://www.mouser.com.tr/ProductDetail/Vishay-Dale/CRCW040210K0FKED?qs=sGAEpiMZZMu61qfTUdNhG2DpbjADlD3GcalbOv9utCY%3D
R93 = Resistor - 47K [0402]: as R82 on sheet GSM Status LED Driver; ComponentLink1Description: DataSheet; ComponentLink1URL: https://www.mouser.com.tr/datasheet/2/427/dcrcwe3-1762152.pdf; ComponentLink2Description: Mouser; ComponentLink2URL: https://www.mouser.com.tr/ProductDetail/Vishay-Dale/CRCW040247K0FKED?qs=sGAEpiMZZMu61qfTUdNhG2DpbjADlD3GL%252B3h1elTxqU%3D

## Sheet GSM Power LED Driver.SchDoc: GSM Power LED Driver
size 292 x 193 mm; SheetNumber: 31; SheetTotal: 40
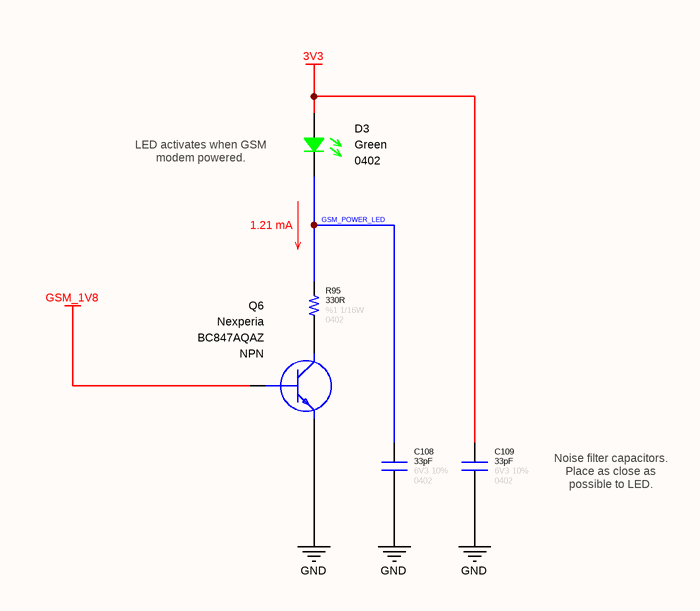
[diagram p36: GSM Power LED Driver.SchDoc]

### Parts
C108  value 33pF  Tolerance: 10%  Case: 0402  Voltage: 6V3  [CAPACITOR_0402]  (hidden comment: Capacitor - 33pF [0402] (Ceramic))
C109  value 33pF  Tolerance: 10%  Case: 0402  Voltage: 6V3  [CAPACITOR_0402]  (hidden comment: Capacitor - 33pF [0402] (Ceramic))
D3  Case: 0402  Color: Green  [LED_0402]  (hidden comment: SMD LED (Green))
Q6  Manufacturer Name: Nexperia  Polarity: NPN  [SOT1215]  (hidden comment: BC847AQAZ)
R95  value 330R  Case: 0402  Tolerance: %1  Power: 1/16W  [RESISTOR_0402]  (hidden comment: 330R - 0402 - %1 - 1/16W)

### Nets
3V3: C109.2 D3.2
GND: C108.1 C109.1 Q6.2(E)
GSM_1V8: Q6.1(B)
GSM_POWER_LED: C108.2 D3.1 R95.2
NetQ6_3: Q6.3(C) R95.1

### Notes on the sheet
- (near D3) LED activates when GSM modem powered.
- 1.21 mA
- Noise filter capacitors. Place as close as possible to LED.
- © 2022 All rights reserved.
  This document may not, in whole or in part, be copied, photocopied, reproduced, translated or converted to any electronic or machine readable from without prior written permission of Mehmet Günce Akkoyun.
  Engineer contact : akkoyun@me.com
- Property of
- Engineer :
- Date :
- Size :
- A4
- Time :
- Project :
- Page :
- /
- Customer :
- Product ID :
- Module ID :
- Version :
- File :
- Revision :

### Library data of the parts
C108 C109 = Capacitor - 33pF [0402-6V3]: as C86 on sheet GSM Status LED Driver; ComponentLink1Description: DataSheet; ComponentLink1URL: https://api.kemet.com/component-edge/download/datasheet/C0402C330J9RACAUTO.pdf; ComponentLink2Description: Mouser; ComponentLink2URL: https://www.mouser.com/Search/Refine.aspx?Keyword=80-C0402C330J9RAUTO
D3 = Diode - LED (0402-Green): as D1 on sheet GSM Status LED Driver; ROHS: Yes; ComponentLink1Description: DataSheet; ComponentLink1URL: https://www.mouser.com.tr/datasheet/2/348/sml-p1-e-1139198.pdf; ComponentLink2Description: Mouser; ComponentLink2URL: https://www.mouser.com.tr/ProductDetail/ROHM-Semiconductor/SML-P12U2TT86R?qs=sGAEpiMZZMseGfSY3csMkRIBDsfU3UCXJTULB5gem9Ta%252Bp%252BvZ709fg%3D%3D
Q6 = Transistor - BC847: Bipolar NPN Transistors; Case: DFN-1010D-3; Manufacturer Part Number: BC847AQAZ
R95 = Resistor - 330R [0402]: as R80 on sheet GSM Status LED Driver; ComponentLink1Description: DataSheet; ComponentLink1URL: https://www.mouser.com.tr/datasheet/2/427/dcrcwe3-1762152.pdf; ComponentLink2Description: Mouser; ComponentLink2URL: https://www.mouser.com.tr/ProductDetail/Vishay-Dale/CRCW0402330RFKED?qs=sGAEpiMZZMu61qfTUdNhG2DpbjADlD3GGS6SwBlLi5Q%3D

## Sheet GSM USB Port.SchDoc: GSM USB Port
size 292 x 193 mm; SheetNumber: 36; SheetTotal: 40
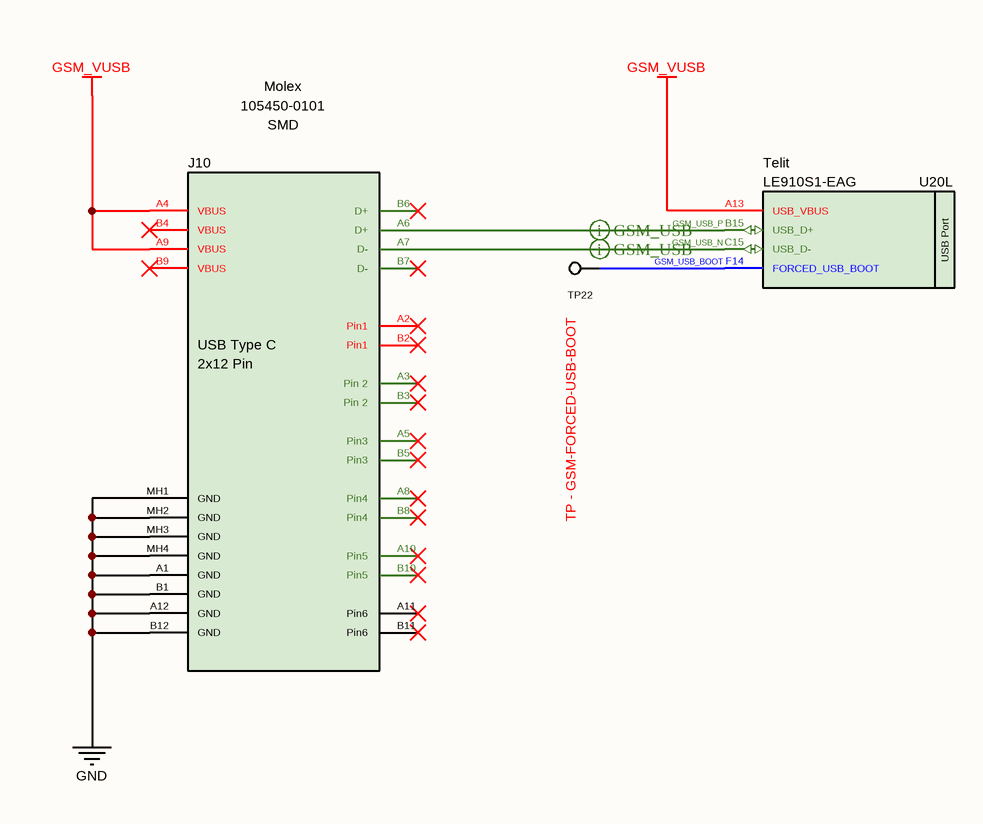
[diagram p37: GSM USB Port.SchDoc]

### Parts
J10  Manufacturer Name: Molex  Case: SMD  [USB Type C - Molex 105450-0101]  (hidden comment: 105450-0101)
TP22  TP - GSM-FORCED-USB-BOOT  [TP]  (no BOM)
U20  Manufacturer Part Number: LE910S1-EAG  Manufacturer Name: Telit  [LE910 GSM Modem]  (hidden comment: LE910S1-EAG LTE GSM Module)  (part L of 19)

### Nets
GND: J10.A1(GND) J10.A12(GND) J10.B1(GND) J10.B12(GND) J10.MH1(GND) J10.MH2(GND) J10.MH3(GND) J10.MH4(GND)
GSM_VUSB: J10.A4(VBUS) J10.A9(VBUS) U20.A13(USB_VBUS)
GSM_USB_BOOT: TP22.1 U20.F14(FORCED_USB_BOOT)
GSM_USB_N: J10.A7(D-) U20.C15(USB_D-)
GSM_USB_P: J10.A6(D+) U20.B15(USB_D+)

Not connected (* = marked no-connect by the designer): J10 A2(Pin1)* A3(Pin_2)* A5(Pin3)* A8(Pin4)* A10(Pin5)* A11(Pin6)* B2(Pin1)* B3(Pin_2)* B4(VBUS)* B5(Pin3)* B6(D+)* B7(D-)* B8(Pin4)* B9(VBUS)* B10(Pin5)* B11(Pin6)*

### Layout directives
differential pair: GSM_USB_N, GSM_USB_P

### Notes on the sheet
- © 2022 All rights reserved.
  This document may not, in whole or in part, be copied, photocopied, reproduced, translated or converted to any electronic or machine readable from without prior written permission of Mehmet Günce Akkoyun.
  Engineer contact : akkoyun@me.com
- Property of
- Engineer :
- Date :
- Size :
- A4
- Time :
- Project :
- Page :
- /
- Customer :
- Product ID :
- Module ID :
- Version :
- File :
- Revision :
- (in symbol Connector - USB Type C SMD Connector) USB Type C; 2x12 Pin
- (in symbol IC - LE910S1-EAG, part L) USB Port

### Library data of the parts
J10 = Connector - USB Type C SMD Connector: USB Shielded I/O Receptacle; Type C; Right Angle; Surface Mount; Gold over Nickel; Current Rating: 5 A.; Gender: Jack (Female); Number of Contacts: 24 Contact; Voltage Rating: 30 V; Maximum Operating Temperature: + 85 C; Minimum Operating Temperature: - 30 C; Mounting Angle: Right Angle; Product Type: USB Connectors; RoHS: Yes; Manufacturer Part Number: 105450-0101
TP22 = PCB - Test Point: Test Point
U20 = IC - LE910S1-EAG: Telit LE910S1-EAG GPRS/GNSS Module; Case: BGA

## Sheet MicroController Core.SchDoc: Micro Controller
size 292 x 193 mm; SheetNumber: 38; SheetTotal: 40
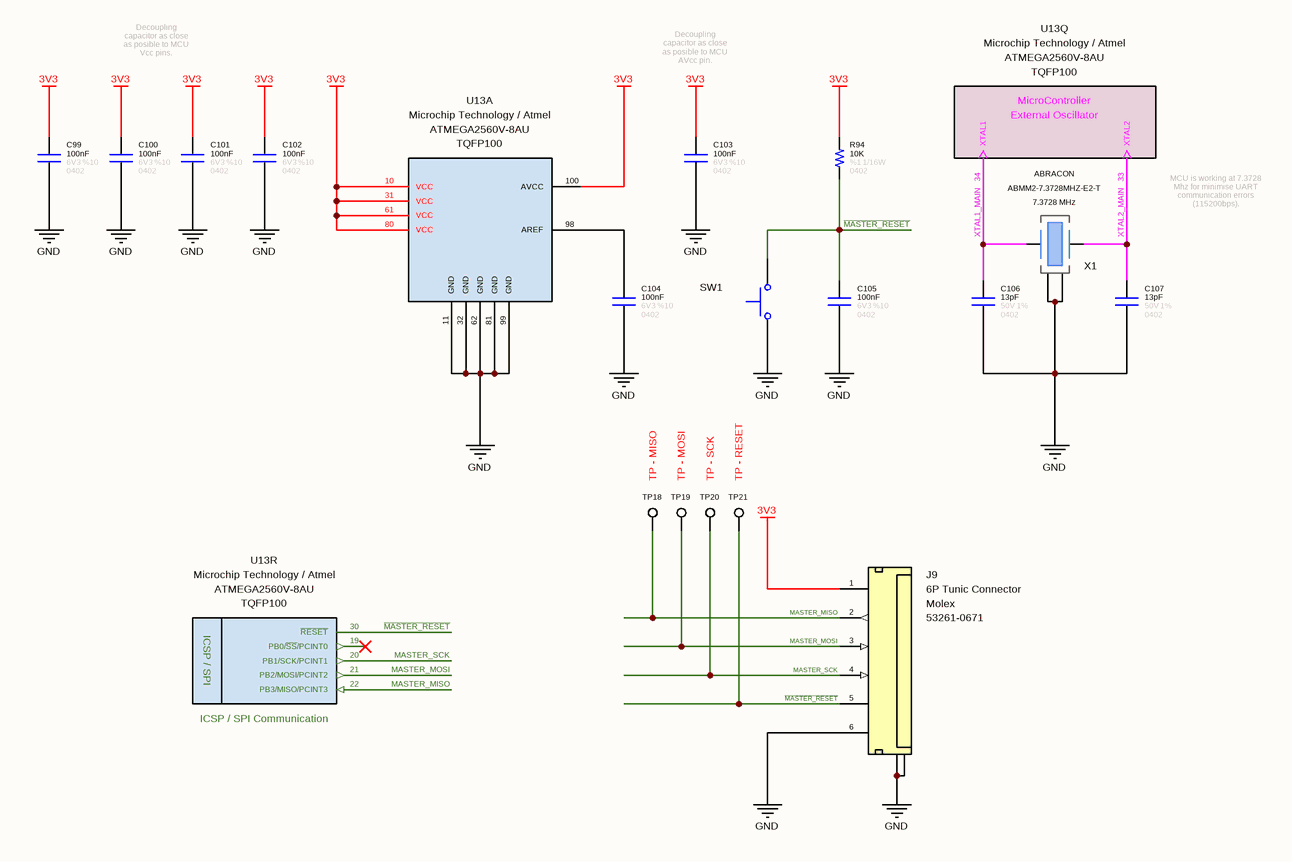
[diagram p38: MicroController Core.SchDoc]

### Parts
C99  value 100nF  Tolerance: %10  Voltage: 6V3  Case: 0402  [CAPACITOR_0402]  (hidden comment: Capacitor - 100nF [0402] (Ceramic))
C100  value 100nF  Tolerance: %10  Voltage: 6V3  Case: 0402  [CAPACITOR_0402]  (hidden comment: Capacitor - 100nF [0402] (Ceramic))
C101  value 100nF  Tolerance: %10  Voltage: 6V3  Case: 0402  [CAPACITOR_0402]  (hidden comment: Capacitor - 100nF [0402] (Ceramic))
C102  value 100nF  Tolerance: %10  Voltage: 6V3  Case: 0402  [CAPACITOR_0402]  (hidden comment: Capacitor - 100nF [0402] (Ceramic))
C103  value 100nF  Tolerance: %10  Voltage: 6V3  Case: 0402  [CAPACITOR_0402]  (hidden comment: Capacitor - 100nF [0402] (Ceramic))
C104  value 100nF  Tolerance: %10  Voltage: 6V3  Case: 0402  [CAPACITOR_0402]  (hidden comment: Capacitor - 100nF [0402] (Ceramic))
C105  value 100nF  Tolerance: %10  Voltage: 6V3  Case: 0402  [CAPACITOR_0402]  (hidden comment: Capacitor - 100nF [0402] (Ceramic))
C106  value 13pF  Tolerance: 1%  Case: 0402  Voltage: 50V  [CAPACITOR_0402]  (hidden comment: Capacitor - 13pF [0402] (Ceramic))
C107  value 13pF  Tolerance: 1%  Case: 0402  Voltage: 50V  [CAPACITOR_0402]  (hidden comment: Capacitor - 13pF [0402] (Ceramic))
J9  6P Tunic Connector  Manufacturer Part Number: 53261-0671  Manufacturer Name: Molex  [Connector_Tunic 6P]
R94  value 10K  Tolerance: %1  Case: 0402  Power: 1/16W  [RESISTOR_0402]  (hidden comment: 10K - 0402 - %1 - 1/16W)
SW1  PTS526SK08SMTR2LFS  [PTS526_Switch]  (value not drawn)
TP18  TP - MISO  [TP]  (no BOM)
TP19  TP - MOSI  [TP]  (no BOM)
TP20  TP - SCK  [TP]  (no BOM)
TP21  TP - RESET  [TP]  (no BOM)
U13  Manufacturer Name: Microchip Technology / Atmel  Case: TQFP100  [TQFP-100]  (hidden comment: ATMEGA2560V-8AU)  (parts A,Q,R of 18)
X1  Manufacturer Name: ABRACON  Frequency: 7.3728 MHz  [CRYSTAL - 7.3728 MHz]  (hidden comment: ABMM2-7.3728MHZ-E2-T)

### Nets
3V3: C99.2 C100.2 C101.2 C102.2 C103.2 J9.1(VBAT) R94.2 U13.10(VCC) U13.31(VCC) U13.61(VCC) U13.80(VCC) U13.100(AVCC)
GND: C99.1 C100.1 C101.1 C102.1 C103.1 C104.1 C105.1 C106.1 C107.1 J9.6(M_DRV) J9.7(GND) J9.8(GND) SW1.1(NC) U13.11(GND) U13.32(GND) U13.62(GND) U13.81(GND) U13.99(GND) X1.2(GND) X1.4(GND)
~{MASTER_RESET}: C105.2 J9.5(M_DRV) R94.1 SW1.2(COM) TP21.1 U13.30(~{RESET})
MASTER_MISO: J9.2(M_DRV) TP18.1 U13.22(PB3/MISO/PCINT3)
MASTER_MOSI: J9.3(M_DRV) TP19.1 U13.21(PB2/MOSI/PCINT2)
MASTER_SCK: J9.4(M_DRV) TP20.1 U13.20(PB1/SCK/PCINT1)
XTAL1_MAIN: C106.2 U13.34(XTAL1) X1.3(OUT/IN)
XTAL2_MAIN: C107.2 U13.33(XTAL2) X1.1(IN/OUT)
NetC104_2: C104.2 U13.98(AREF)

Not connected (* = marked no-connect by the designer): U13 19(PB0/~{SS}/PCINT0)*

### Notes on the sheet
- Decoupling capacitor as close as posible to MCU Vcc pins.
- Decoupling capacitor as close as posible to MCU AVcc pin.
- (near U13) MCU is working at 7.3728 Mhz for minimise UART communication errors (115200bps).
- © 2022 All rights reserved.
  This document may not, in whole or in part, be copied, photocopied, reproduced, translated or converted to any electronic or machine readable from without prior written permission of Mehmet Günce Akkoyun.
  Engineer contact : akkoyun@me.com
- Property of
- Engineer :
- Date :
- Size :
- A4
- Time :
- Project :
- Page :
- /
- Customer :
- Product ID :
- Module ID :
- Version :
- File :
- Revision :
- (in symbol IC - AtMega2560V-8AU, part Q) MicroController; External Oscillator
- (in symbol IC - AtMega2560V-8AU, part R) ICSP / SPI; ICSP / SPI Communication

### Library data of the parts
C99-C105 = Capacitor - 100nF [0402-6V3]: as C81 on sheet GSM SIM Socket; ComponentLink1Description: Mouser; ComponentLink1URL: https://www.mouser.com.tr/ProductDetail/AVX/04026D104KAT4A?qs=sGAEpiMZZMs0AnBnWHyRQPg4iYkCw7IMED%2F4kpqgf7w%3D; ComponentLink2Description: DataSheet; ComponentLink2URL: https://www.mouser.com.tr/datasheet/2/40/cx5r-776519.pdf
C106 C107 = Capacitor - 13pF [0402-50V]: Multilayer Ceramic Capacitors - SMD - 50V 13pF X5R 0402 1%; Manufacturer Part Number: CBR04C130F5GAC; Manufacturer Name: KEMET
J9 = Connector - Mini Tunic 6P (1.25): Mini Tunic Connector with 6P; ROHS: Yes
R94 = Resistor - 10K [0402]: as R88 on sheet GSM On-Off Signal Control; ComponentLink1Description: DataSheet; ComponentLink1URL: https://www.mouser.com.tr/datasheet/2/427/dcrcwe3-1762152.pdf; ComponentLink2Description: Mouser; ComponentLink2URL: https://www.mouser.com.tr/ProductDetail/Vishay-Dale/CRCW040210K0FKED?qs=sGAEpiMZZMu61qfTUdNhG2DpbjADlD3GcalbOv9utCY%3D
SW1 = Switch - Push Button: Switch Tactile N.O. SPST Flush Round Button Gull Wing 0.05A 12VDC 200000Cycles 2.45N SMD T/R; Manufacturer Name: C&K Switches; Current Rating: 50 mA; Contact Form: SPST; Product Type: Tactile Switches; RoHS: Yes; Voltage Rating: 12 VDC; Case: SMD; Manufacturer Part Number: PTS526SK08SMTR2LFS
TP18-TP21 = PCB - Test Point: Test Point
U13 = IC - AtMega2560V-8AU: ATmega Series 256 KB Flash 8 KB SRAM 8 MHz 8-Bit Microcontroller - TQFP-100; Program Memory Size: 256 kB; Core: AVR; Operating Supply Voltage: 2.7 V to 5.5 V; Maximum Clock Frequency: 8 MHz; Maximum Operating Temperature: + 85 C; Product Type: MicroControllers; Minimum Operating Temperature: - 40 C; Manufacturer Part Number: ATMEGA2560V-8AU
X1 = Crystal - 7.3728MHz: CRYSTAL 7.3728MHZ 18PF SMD; ESR: 150 Ohms; Product Type: Crystals; Minimum Operating Temperature: - 20 C; Maximum Operating Temperature: + 70 C; Load Capacitance: 18 pF; RoHS: Yes; Case: SMD; Manufacturer Part Number: ABMM2-7.3728MHZ-E2-T